# EAGLE schematic Relay Driver_V1.1 (EAGLE 7.1.0)
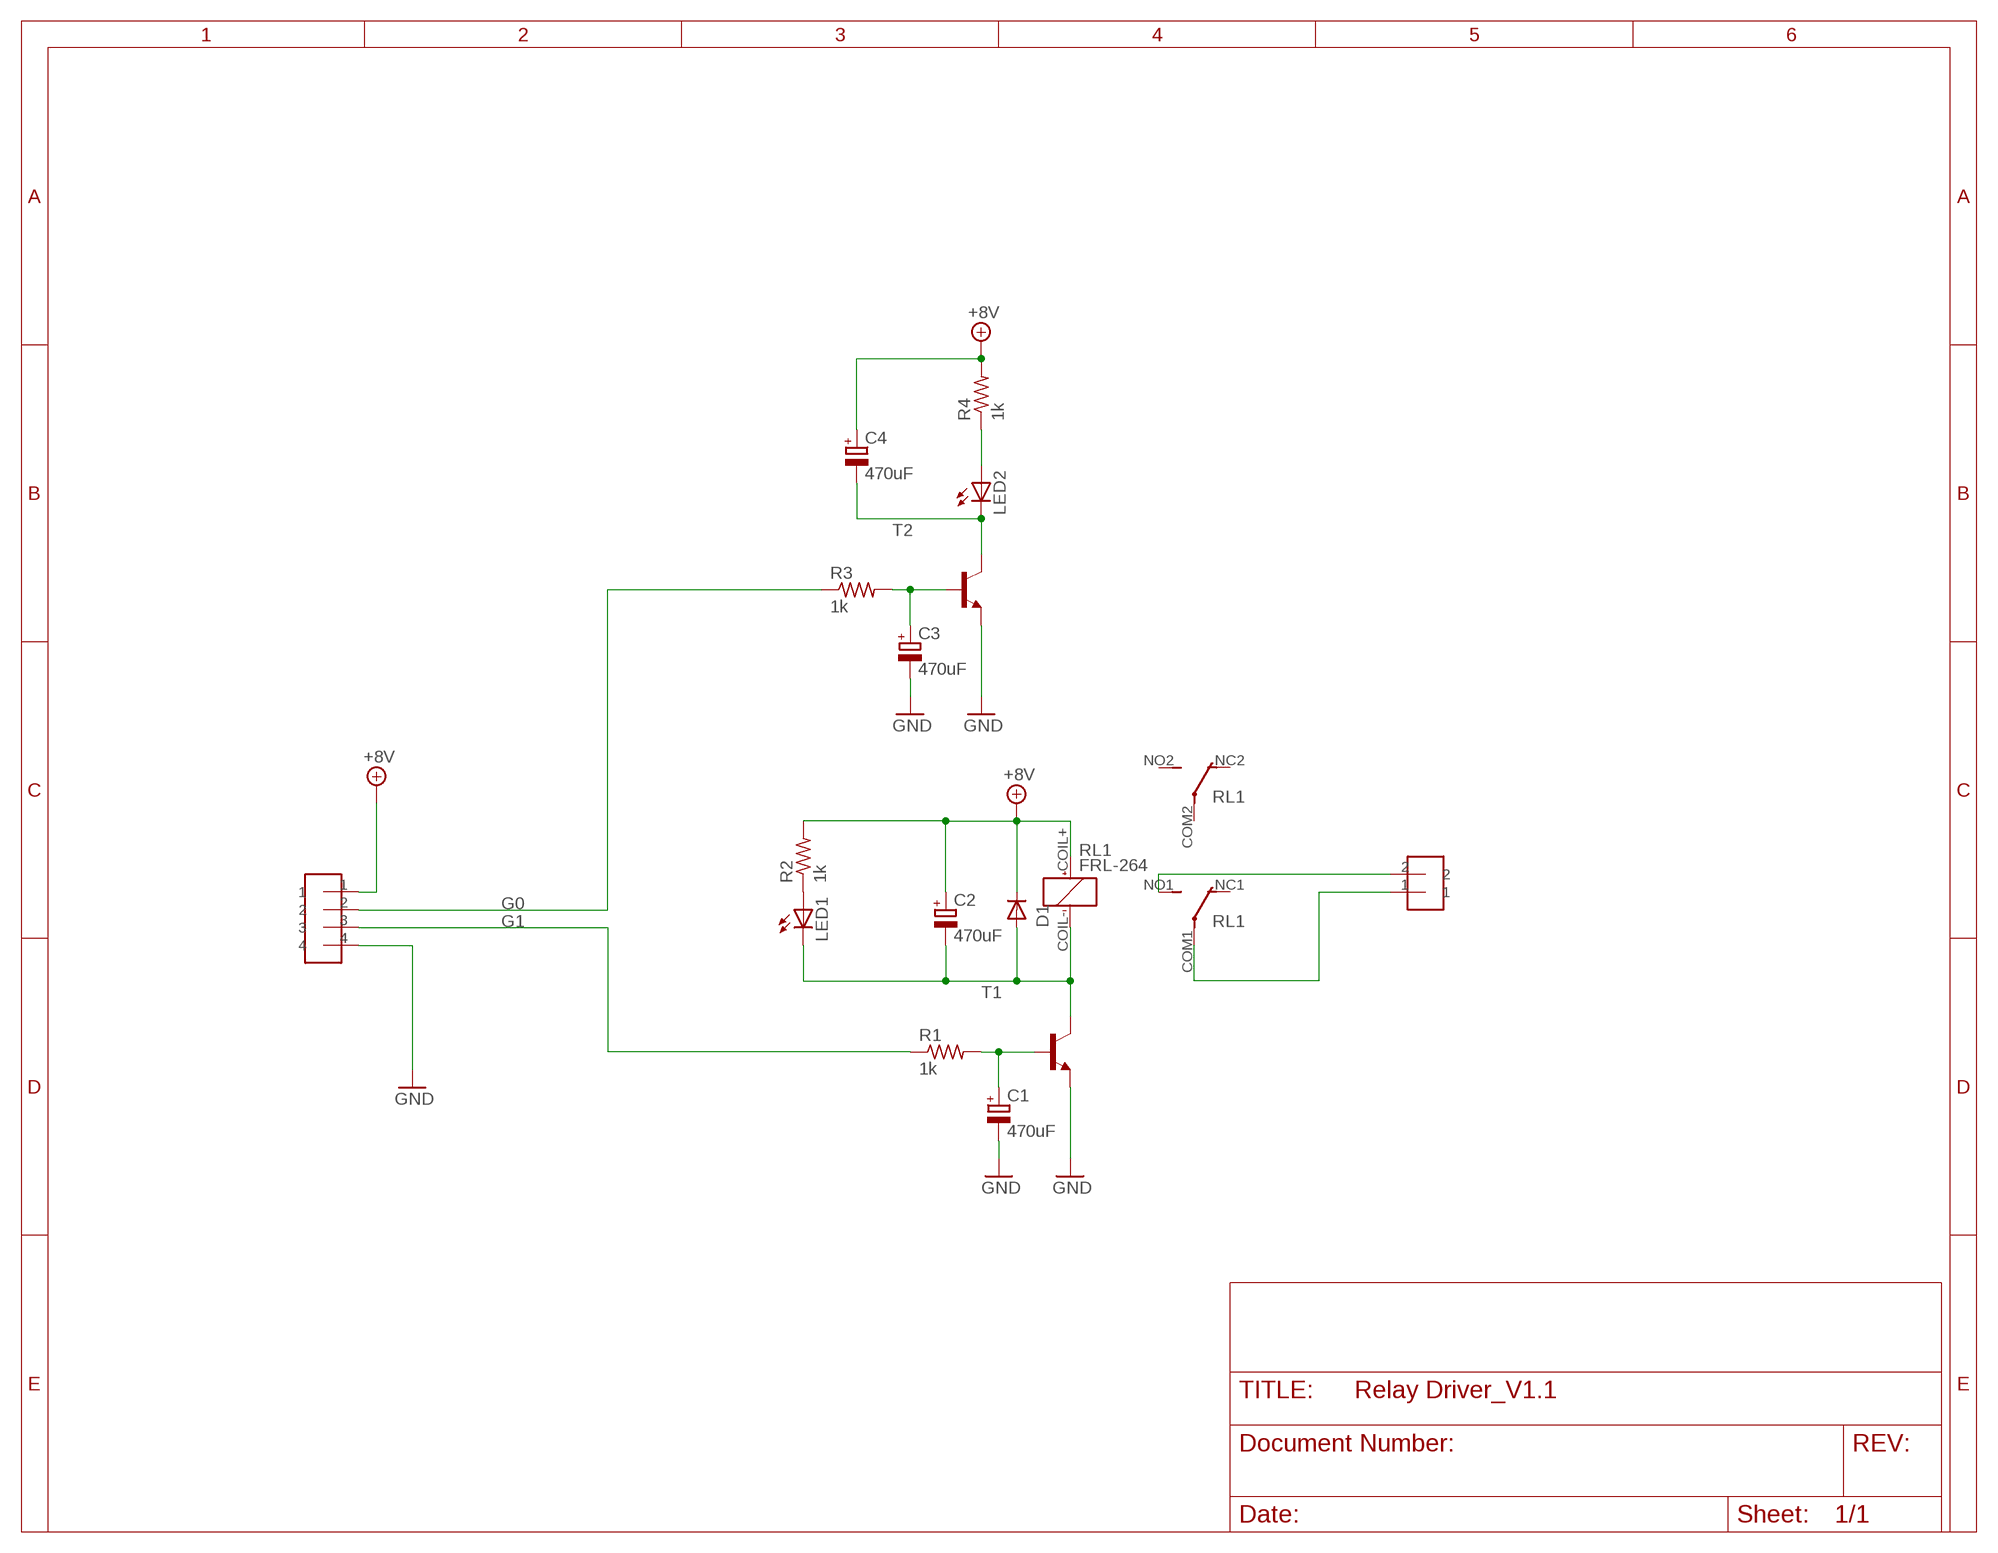
[diagram p0: schematic, sheet 1]

## Parts
C1  470uF  CPOL-EUE3.5-10  [E3,5-10]
C2  470uF  CPOL-EUE3.5-10  [E3,5-10]
C3  470uF  CPOL-EUE3.5-10  [E3,5-10]
C4  470uF  CPOL-EUE3.5-10  [E3,5-10]
D1  1N4148DO35-10  [DO35-10]
LED1  LED5MM  [LED5MM]
LED2  LED5MM  [LED5MM]
R1  1k  R-US_0613/5V  [P0613V]
R2  1k  R-US_0613/5V  [P0613V]
R3  1k  R-US_0613/5V  [P0613V]
R4  1k  R-US_0613/5V  [P0613V]
RL1  FRL-264  [FRL-264]
T1  -NPN-TO92-EBC  [TO92-EBC]
T2  -NPN-TO92-EBC  [TO92-EBC]
U$1  1X4HEADER_100MIL  [1X4_100MIL]
U$2  1X2HEADER_100MIL  [1X2_100MIL]

## Nets
+8V: C2.+ C4.+ D1.C R2.2 R4.2 RL1.COIL+(+) U$1.1
G0: R3.1 U$1.2
G1: R1.1 U$1.3
GND: C1.- C3.- T1.E T2.E U$1.4
N$1: C1.+ R1.2 T1.B
N$2: RL1.NO1(S) U$2.2
N$3: C3.+ R3.2 T2.B
N$4: C2.- D1.A LED1.K(C) RL1.COIL-(-) T1.C
N$5: RL1.COM1(P) U$2.1
N$7: C4.- LED2.K(C) T2.C
N$9: LED1.A R2.1
N$10: LED2.A R4.1
Unconnected: RL1.COM2(P) RL1.NC1(O) RL1.NC2(O) RL1.NO2(S)

## Library data of the parts
C1-C4 = rcl:CPOL-EU: POLARIZED CAPACITOR, European symbol
D1 = diode:1N4148: DIODE high speed (Philips)
LED1 LED2 = led:LED: LED OSRAM: - CHIPLED LG R971, LG N971, LY N971, LG Q971, LY Q971, LO R971, LY R971 LH N974, LH R974 LS Q976, LO Q976, LY Q976 LO Q996 - Hyper CHIPLED LW Q18S LB Q993, LB Q99A, LB R99A - SideLED LS A670, LO A670, LY A670, LG A670, LP A670 LB A673, LV A673, LT A673, LW A673 LH A674 LY A675 LS A676, LA A676, LO A676, LY A676, LW A676 LS A679, LY A679, LG A679 - Hyper Micro SIDELED® LS Y876, LA Y876, LO Y876, LY Y876 LT Y87S - SmartLED LW L88C, LW L88S LB L89C, LB L89S, LG L890 LS L89K, LO L89K, LY L89K LS L896, LA L896, LO L896, LY L896 - TOPLED LS T670, LO T670, LY T670, LG T670, LP T670 LSG T670, LSP T670, LSY T670, LOP T670, LYG T670 LG T671, LOG T671, LSG T671 LB T673, LV T673, LT T673, LW T673 LH T674 LS T676, LA T676, LO T676, LY T676, LB T676, LH T676, LSB T676, LW T676 LB T67C, LV T67C, LT T67C, LS T67K, LO T67K, LY T67K, LW E67C LS E67B, LA E67B, LO E67B, LY E67B, LB E67C, LV E67C, LT E67C LW T67C LS T679, LY T679, LG T679 LS T770, LO T770, LY T770, LG T770, LP T770 LB T773, LV T773, LT T773, LW T773 LH T774 LS E675, LA E675, LY E675, LS T675 LS T776, LA T776, LO T776, LY T776, LB T776 LHGB T686 LT T68C, LB T68C - Hyper Mini TOPLED® LB M676 - Mini TOPLED Santana® LG M470 LS M47K, LO M47K, LY M47K Source: http://www.osram.convergy.de LUXEON: - LUMILED® LXK2-PW12-R00, LXK2-PW12-S00, LXK2-PW14-U00, LXK2-PW14-V00 LXK2-PM12-R00, LXK2-PM12-S00, LXK2-PM14-U00 LXK2-PE12-Q00, LXK2-PE12-R00, LXK2-PE12-S00, LXK2-PE14-T00, LXK2-PE14-U00 LXK2-PB12-K00, LXK2-PB12-L00, LXK2-PB12-M00, LXK2-PB14-N00, LXK2-PB14-P00, LXK2-PB14-Q00 LXK2-PR12-L00, LXK2-PR12-M00, LXK2-PR14-Q00, LXK2-PR14-R00 LXK2-PD12-Q00, LXK2-PD12-R00, LXK2-PD12-S00 LXK2-PH12-R00, LXK2-PH12-S00 LXK2-PL12-P00, LXK2-PL12-Q00, LXK2-PL12-R00 Source: www.luxeon.com KINGBRIGHT: KA-3528ASYC Source: www.kingbright.com
R1-R4 = rcl:R-US_: RESISTOR, American symbol
RL1 = relay:FRL-264
T1 T2 = transistor:*-NPN-: NPN Transistror BF959 corrected 2008.03.06
U$1 = Headers:1X4HEADER_100MIL
U$2 = Headers:1X2HEADER_100MIL